# Altium schematic sheet main.SchDoc
size 840 x 594 mm; CheckedBy: Смирнова; Author: Соколов; DrawnBy: Соколов; Organization: БГУИР, 750701; DocumentNumber: ГУИР.123456.001 Э3; SheetNumber: 1; SheetTotal: 1; Title1str: Дистанционная система; Title2str: управления климатом дома
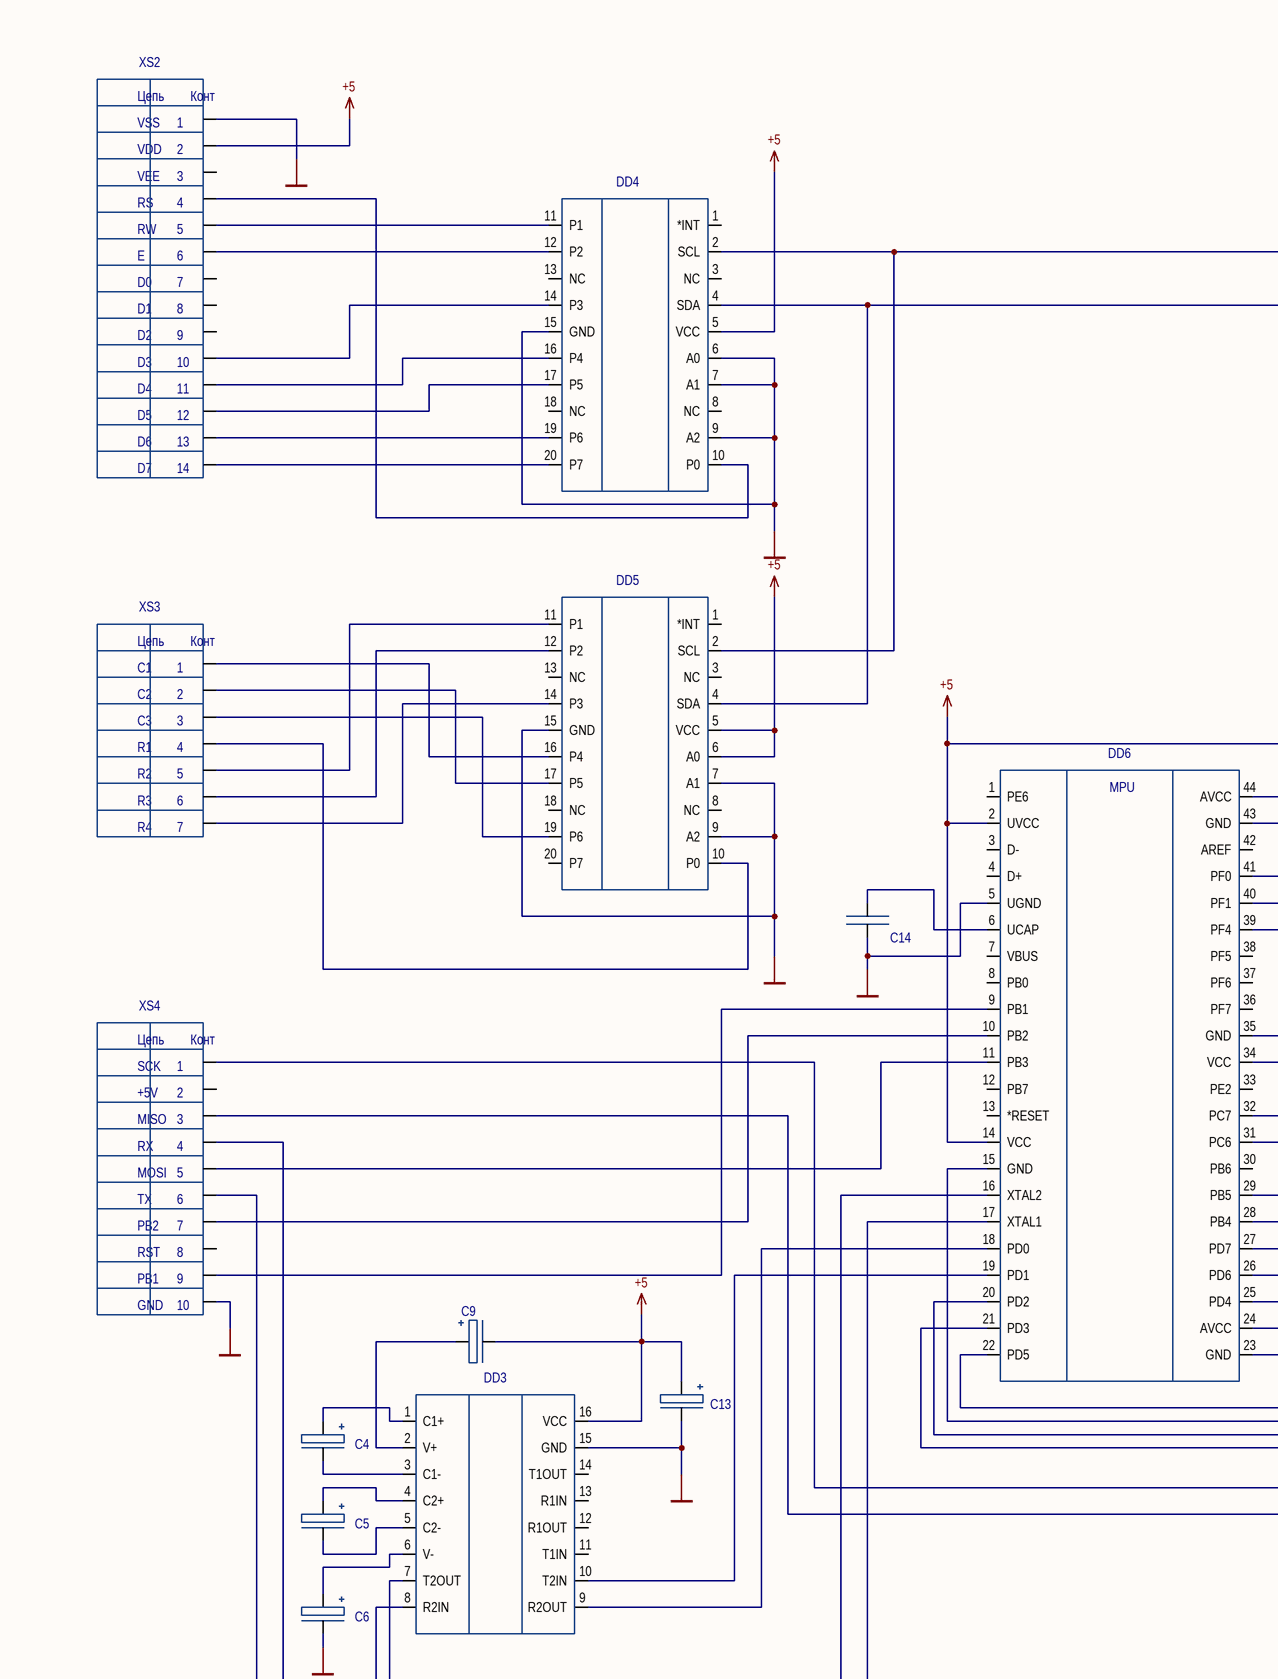
[diagram p0: main.SchDoc, top left]
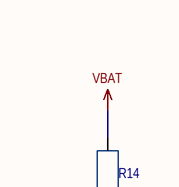
[diagram p1: main.SchDoc, top right]
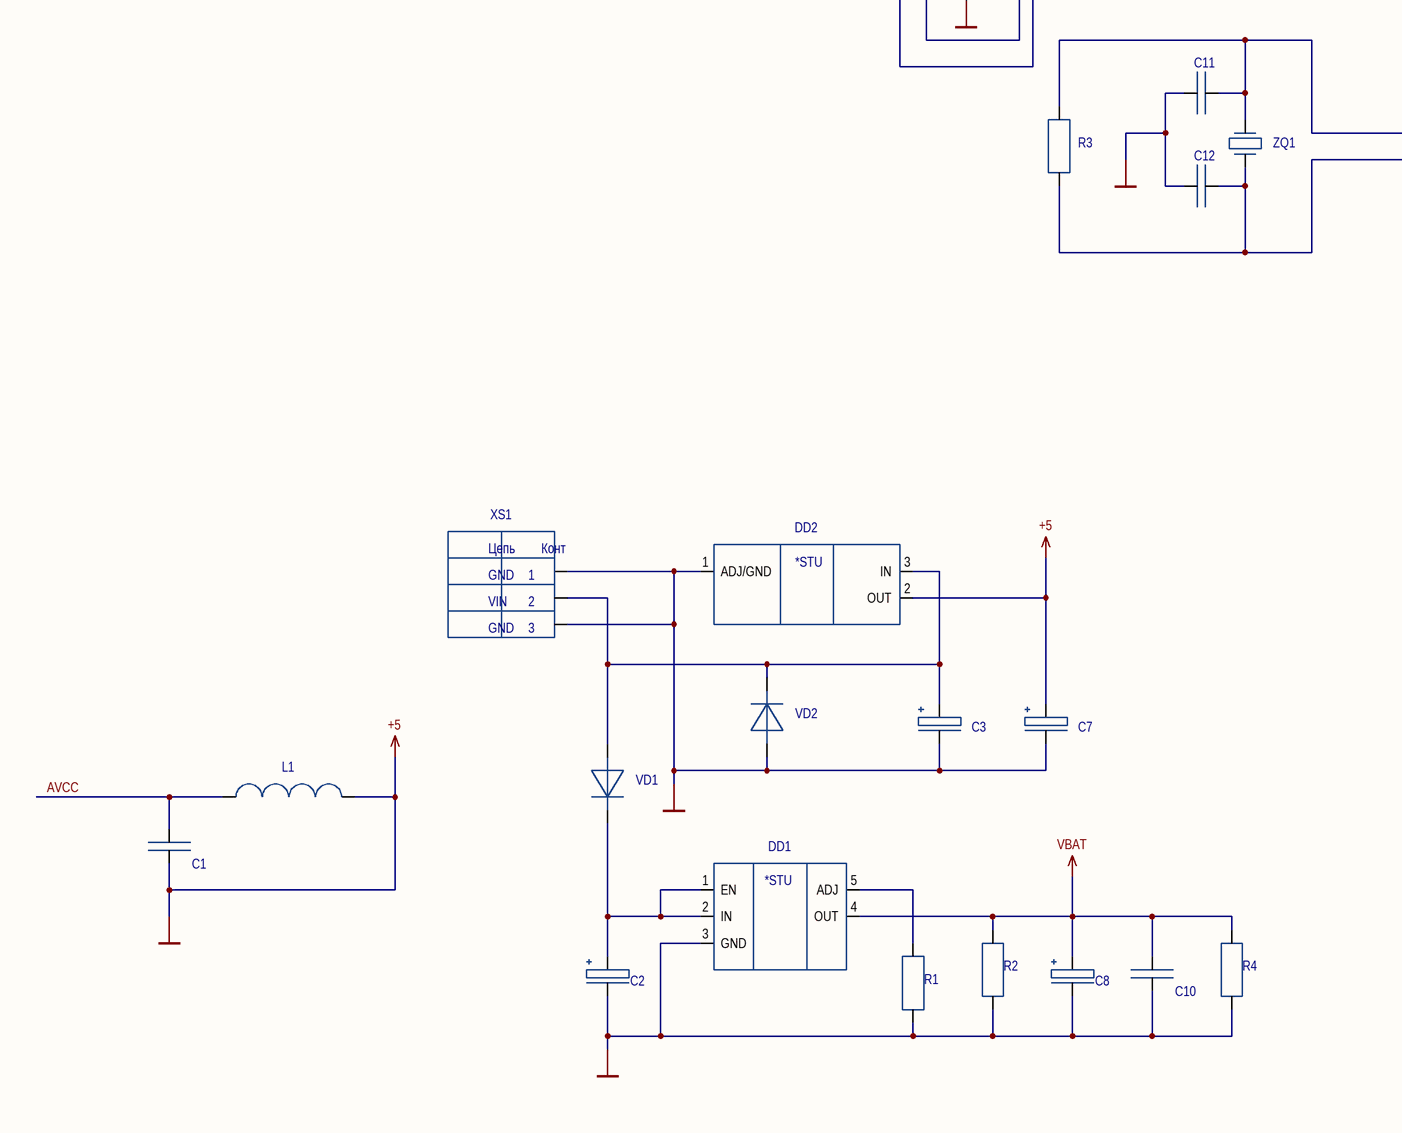
[diagram p2: main.SchDoc, bottom left]
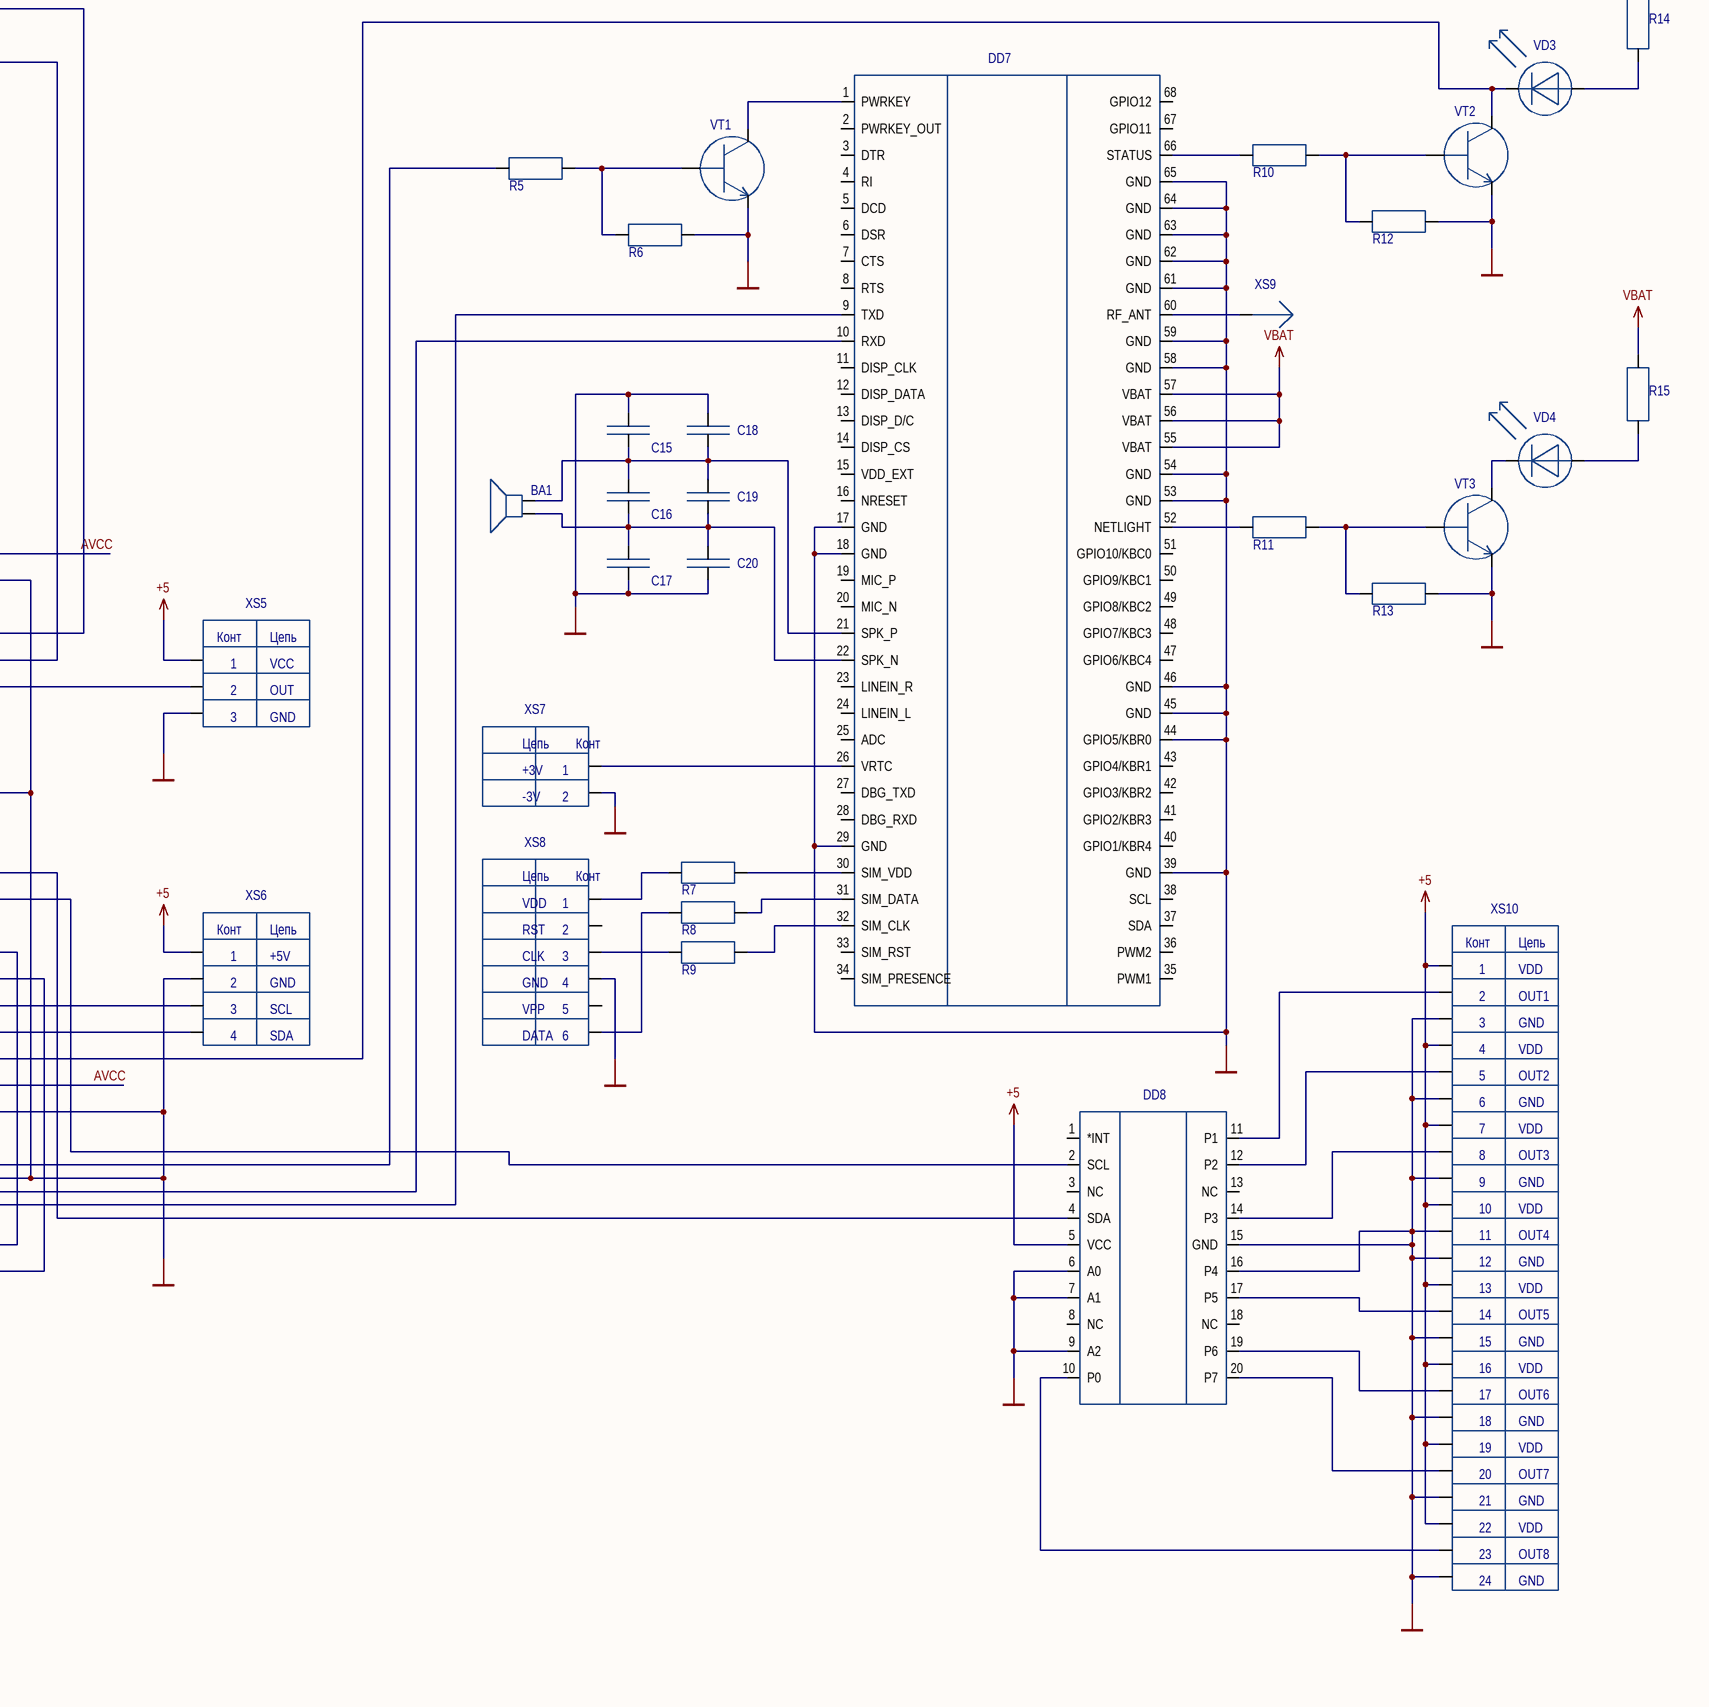
[diagram p3: main.SchDoc, bottom right]

## Parts
BA1  beeper_HPA17F  (value not drawn)
C1  cap_1mkF  (value not drawn)
C2  cap_pol_100mkF  (value not drawn)
C3  pol_10mkF  (value not drawn)
C4  pol_1mkF  (value not drawn)
C5  pol_1mkF  (value not drawn)
C6  pol_1mkF  (value not drawn)
C7  pol_10mkF  (value not drawn)
C8  cap_pol_100mkF  (value not drawn)
C9  pol_1mkF  (value not drawn)
C10  cap_100nF  (value not drawn)
C11  33pF  (value not drawn)
C12  33pF  (value not drawn)
C13  pol_1mkF  (value not drawn)
C14  cap_1mkF  (value not drawn)
C15  cap_10pF  (value not drawn)
C16  cap_10pF  (value not drawn)
C17  cap_10pF  (value not drawn)
C18  cap_33pF  (value not drawn)
C19  cap_33pF  (value not drawn)
C20  cap_33pF  (value not drawn)
DD1  stu_MIC29302WT  (value not drawn)
DD2  NCP1117ST50T3G  [SOT223-3_ONS]  (value not drawn)
DD3  MAX232CSE+  [21-0041_S16+3_MXM]  (value not drawn)
DD4  PCF8574DGVR  [DGV20]  (value not drawn)
DD5  PCF8574DGVR  [DGV20]  (value not drawn)
DD6  ATMEGA32U4RC-AU  [44ML_ATM]  (value not drawn)
DD7  SIM900A  (value not drawn)
DD8  PCF8574DGVR  [DGV20]  (value not drawn)
L1  inductor_10uH  (value not drawn)
R1  res_47k  (value not drawn)
R2  res_100K  (value not drawn)
R3  res_1M  (value not drawn)
R4  res_510  (value not drawn)
R5  res_4.7k  (value not drawn)
R6  res_47k  (value not drawn)
R7  res_22  (value not drawn)
R8  res_22  (value not drawn)
R9  res_22  (value not drawn)
R10  res_4.7k  (value not drawn)
R11  res_4.7k  (value not drawn)
R12  res_47k  (value not drawn)
R13  res_47k  (value not drawn)
R14  res_510  (value not drawn)
R15  res_510  (value not drawn)
VD1  diode_M7  (value not drawn)
VD2  diode_M7  (value not drawn)
VD3  diode_red  (value not drawn)
VD4  diode_red  (value not drawn)
VT1  BC547  (value not drawn)
VT2  BC547  (value not drawn)
VT3  BC547  (value not drawn)
XS1  power_supply_jack  (value not drawn)
XS2  LCD_connector  (value not drawn)
XS3  conn_Keypad  (value not drawn)
XS4  BH-10  (value not drawn)
XS5  VS1833B  (value not drawn)
XS6  usb_typeA  (value not drawn)
XS7  conn_Battery_CR2032  (value not drawn)
XS8  SIM5051-6-0-18-00-A  [SIM5051-6-0-18-00-A_GCT]  (value not drawn)
XS9  antenn_connector  (value not drawn)
XS10  ds1013  (value not drawn)
ZQ1  crystal_8mhz  (value not drawn)

## Nets
+5: C1.1 C2.1 C3.1 C6.1 C7.1 C7.2 C8.1 C9.1 C10.1 C11.2 C12.2 C13.1 C13.2 C15.2 C17.1 C18.2 C20.1 DD1.3(GND) DD2.1(ADJ/GND) DD2.2(OUT) DD3.15(GND) DD3.16(VCC) DD4.5(VCC) DD4.6(A0) DD4.7(A1) DD4.9(A2) DD4.15(GND) DD5.5(VCC) DD5.6(A0) DD5.7(A1) DD5.9(A2) DD5.15(GND) DD6.2(UVCC) DD6.14(VCC) DD6.15(GND) DD6.23(GND) DD6.34(VCC) DD6.35(GND) DD6.43(GND) DD7.17(GND) DD7.18(GND) DD7.29(GND) DD7.39(GND) DD7.44(GPIO5/KBR0) DD7.45(GND) DD7.46(GND) DD7.53(GND) DD7.54(GND) DD7.58(GND) DD7.59(GND) DD7.61(GND) DD7.62(GND) DD7.63(GND) DD7.64(GND) DD7.65(GND) DD8.5(VCC) DD8.6(A0) DD8.7(A1) DD8.9(A2) DD8.15(GND) DD8.16(P4) L1.2 R1.1 R2.1 R4.1 R6.2 R12.2 R13.2 VD2.1 VT1.1(E) VT2.1(E) VT3.1(E) XS1.1(+5V) XS1.3(SCL) XS2.1(VSS) XS2.2(VDD) XS4.10(D3) XS5.1(VCC) XS5.3(GND) XS6.1(+5V) XS6.2(GND) XS7.2 XS8.4(GND) XS10.1(VSS) XS10.3(VO) XS10.4(C/D) XS10.6(*WR) XS10.7(D0) XS10.9(D2) XS10.10(D3) XS10.11(D4) XS10.12(D5) XS10.13(D6) XS10.15 XS10.16 XS10.18 XS10.19 XS10.21 XS10.22 XS10.24  [also labelled GND]
UGND: C14.1 DD6.5(UGND)
VBAT: C8.2 C10.2 DD1.4(OUT) DD7.55(VBAT) DD7.56(VBAT) DD7.57(VBAT) R2.2 R4.2 R14.2 R15.2
AVCC: C1.2 DD6.24(AVCC) DD6.44(AVCC) L1.1
NetBA1_1: BA1.1 C15.1 C16.2 C18.1 C19.2 DD7.21(SPK_P)
NetBA1_2: BA1.2 C16.1 C17.2 C19.1 C20.2 DD7.22(SPK_N)
NetC2_2: C2.2 DD1.1(EN) DD1.2(IN) VD1.2
NetC3_2: C3.2 DD2.3(IN) VD1.1 VD2.2 XS1.2(GND)
NetC4_1: C4.1 DD3.3(C1-)
NetC4_2: C4.2 DD3.1(C1+)
NetC5_1: C5.1 DD3.5(C2-)
NetC5_2: C5.2 DD3.4(C2+)
NetC6_2: C6.2 DD3.6(V-)
NetC9_2: C9.2 DD3.2(V+)
NetC11_1: C11.1 DD6.16(XTAL2) R3.2 ZQ1.2
NetC12_1: C12.1 DD6.17(XTAL1) R3.1 ZQ1.1
NetC14_2: C14.2 DD6.6(UCAP)
NetDD1_5: DD1.5(ADJ) R1.2
NetDD3_7: DD3.7(T2OUT) XS4.6(*WR)
NetDD3_8: DD3.8(R2IN) XS4.4(C/D)
NetDD3_9: DD3.9(R2OUT) DD6.18(PD0)
NetDD3_10: DD3.10(T2IN) DD6.19(PD1)
NetDD4_2: DD4.2(SCL) DD5.2(SCL) DD6.41(PF0)
NetDD4_4: DD4.4(SDA) DD5.4(SDA) DD6.40(PF1)
NetDD4_10: DD4.10(P0) XS2.4(C/D)
NetDD4_11: DD4.11(P1) XS2.5(*RD)
NetDD4_12: DD4.12(P2) XS2.6(*WR)
NetDD4_14: DD4.14(P3) XS2.10(D3)
NetDD4_16: DD4.16(P4) XS2.11(D4)
NetDD4_17: DD4.17(P5) XS2.12(D5)
NetDD4_19: DD4.19(P6) XS2.13(D6)
NetDD4_20: DD4.20(P7) XS2.14(D7)
NetDD5_10: DD5.10(P0) XS3.4(C/D)
NetDD5_11: DD5.11(P1) XS3.5(*RD)
NetDD5_12: DD5.12(P2) XS3.6(*WR)
NetDD5_14: DD5.14(P3) XS3.7(D0)
NetDD5_16: DD5.16(P4) XS3.1(VSS)
NetDD5_17: DD5.17(P5) XS3.2(VDD)
NetDD5_19: DD5.19(P6) XS3.3(VO)
NetDD6_9: DD6.9(PB1) XS4.9(D2)
NetDD6_10: DD6.10(PB2) XS4.7(D0)
NetDD6_11: DD6.11(PB3) XS4.5(*RD)
NetDD6_20: DD6.20(PD2) DD7.10(RXD)
NetDD6_21: DD6.21(PD3) DD7.9(TXD)
NetDD6_22: DD6.22(PD5) R5.1
NetDD6_25: DD6.25(PD4) VD3.2 VT2.3(C)
NetDD6_26: DD6.26(PD6) XS6.4(SDA)
NetDD6_27: DD6.27(PD7) XS6.3(SCL)
NetDD6_28: DD6.28(PB4) XS4.3(VO)
NetDD6_29: DD6.29(PB5) XS4.1(VSS)
NetDD6_31: DD6.31(PC6) DD8.2(SCL)
NetDD6_32: DD6.32(PC7) DD8.4(SDA)
NetDD6_39: DD6.39(PF4) XS5.2(OUT)
NetDD7_1: DD7.1(PWRKEY) VT1.3(C)
NetDD7_26: DD7.26(VRTC) XS7.1(VCC)
NetDD7_30: DD7.30(SIM_VDD) R7.2
NetDD7_31: DD7.31(SIM_DATA) R8.2
NetDD7_32: DD7.32(SIM_CLK) R9.2
NetDD7_52: DD7.52(NETLIGHT) R11.1
NetDD7_60: DD7.60(RF_ANT) XS9.1
NetDD7_66: DD7.66(STATUS) R10.1
NetDD8_10: DD8.10(P0) XS10.23
NetDD8_11: DD8.11(P1) XS10.2(VDD)
NetDD8_12: DD8.12(P2) XS10.5(*RD)
NetDD8_14: DD8.14(P3) XS10.8(D1)
NetDD8_17: DD8.17(P5) XS10.14(D7)
NetDD8_19: DD8.19(P6) XS10.17
NetDD8_20: DD8.20(P7) XS10.20
NetR5_2: R5.2 R6.1 VT1.2(B)
NetR7_1: R7.1 XS8.1(VCC)
NetR8_1: R8.1 XS8.6(I/O)
NetR9_1: R9.1 XS8.3(CLK)
NetR10_2: R10.2 R12.1 VT2.2(B)
NetR11_2: R11.2 R13.1 VT3.2(B)
NetR14_1: R14.1 VD3.1
NetR15_1: R15.1 VD4.1
NetVD4_2: VD4.2 VT3.3(C)

Not connected (* = marked no-connect by the designer): DD3 11(T1IN) 12(R1OUT) 13(R1IN) 14(T1OUT); DD4 1(*INT) 3(NC) 8(NC) 13(NC) 18(NC); DD5 1(*INT) 3(NC) 8(NC) 13(NC) 18(NC) 20(P7); DD6 1(PE6) 3(D-) 4(D+) 7(VBUS) 8(PB0) 12(PB7) 13(*RESET) 30(PB6) 33(PE2) 36(PF7) 37(PF6) 38(PF5) 42(AREF); DD7 2(PWRKEY_OUT) 3(DTR) 4(RI) 5(DCD) 6(DSR) 7(CTS) 8(RTS) 11(DISP_CLK) 12(DISP_DATA) 13(DISP_D/C) 14(DISP_CS) 15(VDD_EXT) 16(NRESET) 19(MIC_P) 20(MIC_N) 23(LINEIN_R) 24(LINEIN_L) 25(ADC) 27(DBG_TXD) 28(DBG_RXD) 33(SIM_RST) 34(SIM_PRESENCE) 35(PWM1) 36(PWM2) 37(SDA) 38(SCL) 40(GPIO1/KBR4) 41(GPIO2/KBR3) 42(GPIO3/KBR2) 43(GPIO4/KBR1) 47(GPIO6/KBC4) 48(GPIO7/KBC3) 49(GPIO8/KBC2) 50(GPIO9/KBC1) 51(GPIO10/KBC0) 67(GPIO11) 68(GPIO12); DD8 1(*INT) 3(NC) 8(NC) 13(NC) 18(NC); XS2 3(VO) 7(D0) 8(D1) 9(D2); XS4 2(VDD) 8(D1); XS8 2(RST) 5(VPP)

## Notes on the sheet
- Перв. примен.
- Справ. №
- Н.контр.
- Подп. и дата
- Инв. № дубл.
- Разраб.
- Взам. инв. №
- Изм.
- Лист
- № докум.
- Подп.
- Дата
- Лит.
- Масса
- Масштаб
- Пров.
- Т.контр.
- Листов
- Инв. № подл.
- Утв.
- Согласов.
- Копировал
- Формат  A1М
- (in symbol ATMEGA32U4RC-AU) MPU
- (in symbol conn_Battery_CR2032) Цепь; Конт; +3V; -3V
- (in symbol conn_Keypad) Цепь; Конт; C1; C2; C3; R1; R2; R3; R4
- (in symbol LCD_connector) Цепь; Конт; VEE; RS; RW; E
- (in symbol NCP1117ST50T3G) *STU
- (in symbol power_supply_jack) Цепь; Конт; VIN
- (in symbol RS-232) Цепь; Конт; SCK; +5V; MISO; RX; MOSI; TX; PB2; RST; PB1; GND
- (in symbol SIM5051-6-0-18-00-A) Цепь; Конт; VDD; DATA
- (in symbol stu_MIC29302WT) *STU
- (in symbol temperature_sensors_connector) Конт; Цепь; OUT1; GND; OUT2; OUT3; OUT4; OUT5; OUT6; OUT7; OUT8
- (in symbol usb_typeA) Конт; Цепь
- (in symbol VS1833B) Конт; Цепь

## Library data of the parts
C3 C7 = cap_pol_10mkF
C4-C6 C9 C13 = cap_pol_1mkF
C11 C12 = cap_33pF
DD2 = NCP1117ST50T3G: No Description Available; Vendor: ON Semiconductor; SourceLibrary: ONSemi_2017-12-12_4; Manufacturer_Part_Number: NCP1117ST50T3G; Copyright: Copyright (C) 2016 Accelerated Designs. All rights reserved; RefDes: RefDes; Type: DEV
DD3 = MAX232CSE+: No Description Available; SourceLibrary: Update_to_database_2021-01-29; Built_By: EMA_UL_Team; Vendor: Maxim Integrated Products; Revision: 4; Manufacturer_Part_Number: MAX232CSE+; Copyright: Copyright (C) 2018 Accelerated Designs. All rights reserved; RefDes: RefDes; Type: DEV
DD4 DD5 DD8 = PCF8574DGVR: Remote 8-Bit I/O Expander for I2C-Bus; Manufacturer: Texas Instruments; INDUSTRY_STD_PKG_TYPE: TVSOP; FAMILY_NAME: I2C IO EXPANDER; PIN_COUNT: 20; PACKAGE_DESIGNATOR: DGV; Datasheet_URL: http://www.ti.com/lit/gpn/PCF8574; GENERIC_PART_NUMBER: PCF8574; Vendor: Texas Instruments; Manufacturer_Part_Number: PCF8574DGVR; Copyright: Copyright (C) 2018 Accelerated Designs. All rights reserved; RefDes: RefDes; Type: DEV
DD6 = ATMEGA32U4RC-AU: No Description Available; Vendor: Atmel; Built_By: EMA_UL_Team; SourceLibrary: Atmel_2015-02-13; Manufacturer_Part_Number: ATMEGA32U4RC-AU; Copyright: Copyright (C) 2018 Accelerated Designs. All rights reserved; RefDes: RefDes; Type: DEV
XS4 = RS-232
XS8 = SIM5051-6-0-18-00-A: No Description Available; Vendor: Global Connector Technology; Built_By: EMA_Cory; SourceLibrary: GCT_2020-07-23; Datasheet: https://gct.co/files/drawings/sim5051.pdf; Manufacturer_Part_Number: SIM5051-6-0-18-00-A; Copyright: Copyright (C) 2018 Accelerated Designs. All rights reserved; RefDes: RefDes; Type: DEV
XS10 = temperature_sensors_connector